# EAGLE design Adafruit High Voltage UPDI Friend (EAGLE 9.6.2)
COMPANY: ADAFRUIT INDUSTRIES; DRAWN: KTOWN; REV: A
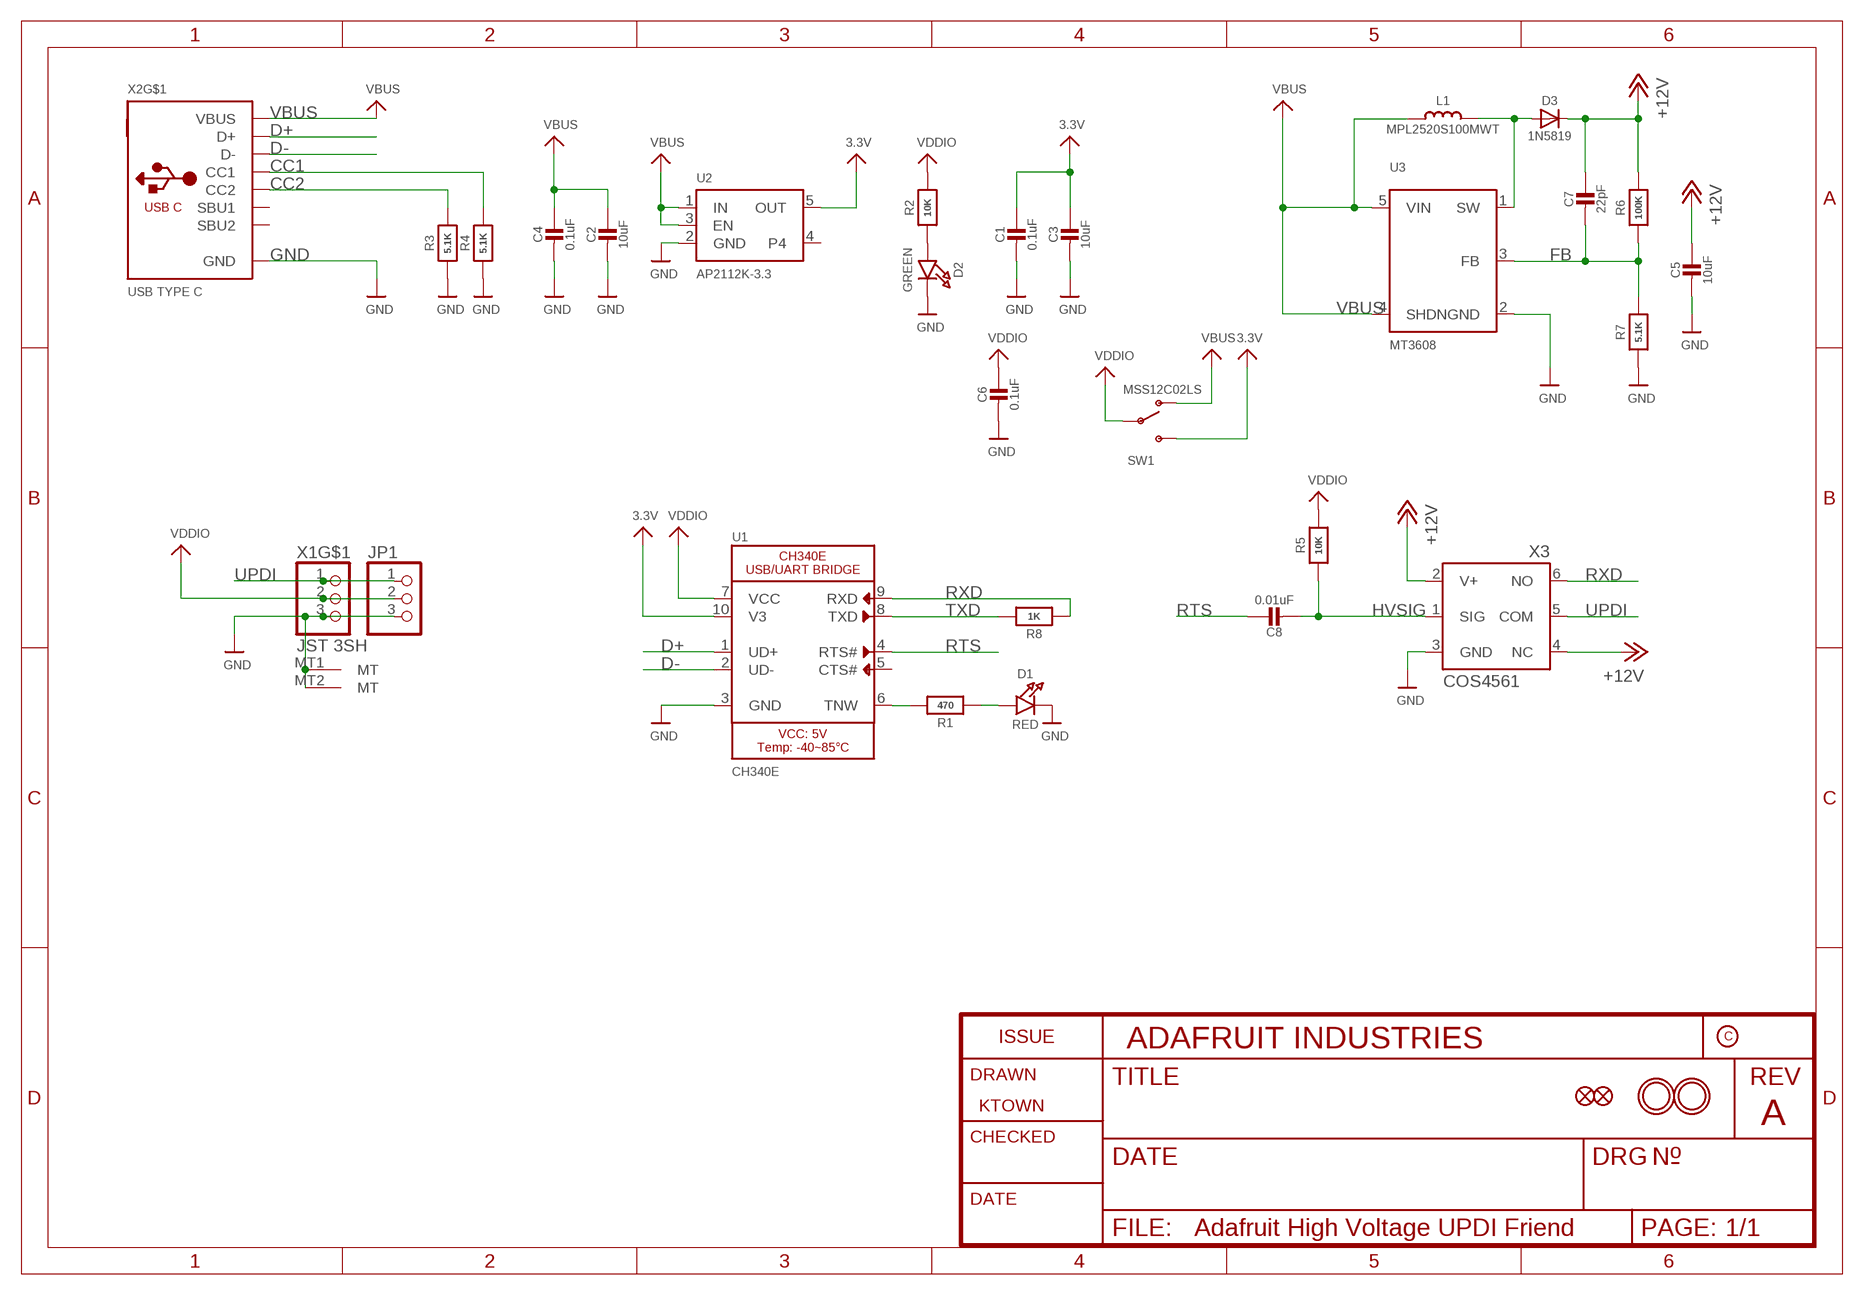
[diagram p0: schematic, sheet 1]

## Parts
C1  0.1uF  CAP_CERAMIC0603_NO  [0603-NO]
C2  10uF  CAP_CERAMIC0805-NOOUTLINE  [0805-NO]
C3  10uF  CAP_CERAMIC0805-NOOUTLINE  [0805-NO]
C4  0.1uF  CAP_CERAMIC0603_NO  [0603-NO]
C5  10uF  CAP_CERAMIC0805-NOOUTLINE  [0805-NO]
C6  0.1uF  CAP_CERAMIC0603_NO  [0603-NO]
C7  22pF  CAP_CERAMIC0603_NO  [0603-NO]
C8  0.01uF  CAP_CERAMIC0603_NO  [0603-NO]
D1  RED  LED0603_NOOUTLINE  [CHIPLED_0603_NOOUTLINE]
D2  GREEN  LED0603_NOOUTLINE  [CHIPLED_0603_NOOUTLINE]
D3  1N5819  DIODESOD-323  [SOD-323]
FID1  FIDUCIAL_1MM  [FIDUCIAL_1MM]
FID2  FIDUCIAL_1MM  [FIDUCIAL_1MM]
JP1  HEADER-1X376MIL  [1X03_ROUND_76]
L1  MPL2520S100MWT  INDUCTOR  [INDUCTOR_1007]
R1  470  RESISTOR_0603_NOOUT  [0603-NO]
R2  10K  RESISTOR_0603_NOOUT  [0603-NO]
R3  5.1K  RESISTOR_0603_NOOUT  [0603-NO]
R4  5.1K  RESISTOR_0603_NOOUT  [0603-NO]
R5  10K  RESISTOR_0603_NOOUT  [0603-NO]
R6  100K  RESISTOR_0603_NOOUT  [0603-NO]
R7  5.1K  RESISTOR_0603_NOOUT  [0603-NO]
R8  1K  RESISTOR_0603_NOOUT  [0603-NO]
SW1  MSS12C02LS  SWITCH_SPDT  [SPDT_SMT_SSSS811101]
U1  CH340E  CH340E_MSOP10  [MSOP10]
U2  AP2112K-3.3  VREG_SOT23-5  [SOT23-5]
U3  MT3608  VREG_BOOST_5PIN_SOT236  [SOT23-6]
U$18  MOUNTINGHOLE2.0  [MOUNTINGHOLE_2.0_PLATED]
U$19  MOUNTINGHOLE2.0  [MOUNTINGHOLE_2.0_PLATED]
X1  JST 3SH  CON_JST_SH_3PINHORZ  [JST_SH3]
X2  USB TYPE C  USB_C  [USB_C_CUSB31-CFM2AX-01-X]
X3  COS4561  [SOT23-6]

## Nets
3.3V: C1.1 C3.1 SW1.C(S) U1.10(V3) U2.5(OUT)
+12V: C5.1 C7.1 D3.C R6.2 X3.2(V+) X3.4(NC)
CC1: R4.2 X2.A5(CC1)
CC2: R3.2 X2.B5(CC2)
D+: U1.1(UD+) X2.A6(D+) X2.B6(D+)
D-: U1.2(UD-) X2.A7(D-) X2.B7(D-)
FB: C7.2 R6.1 R7.2 U3.3(FB)
GND: C1.2 C2.2 C3.2 C4.2 C5.2 C6.2 D1.C D2.C JP1.3 R3.1 R4.1 R7.1 U1.3(GND) U2.2(GND) U3.2(GND) X1.3 X1.MT1(MT) X1.MT2(MT) X2.A1B12(GND) X2.B1A12(GND) X3.3(GND)
HVSIG: C8.2 R5.1 X3.1(SIG)
N$1: D1.A R1.1
N$2: R1.2 U1.6(TNW)
N$3: D3.A L1.P$2 U3.1(SW)
N$5: D2.A R2.1
RTS: C8.1 U1.4(RTS#)
RXD: R8.2 U1.9(RXD) X3.6(NO)
TXD: R8.1 U1.8(TXD)
UPDI: JP1.1 X1.1 X3.5(COM)
VBUS: C2.1 C4.1 L1.P$1 SW1.A(O) U2.1(IN) U2.3(EN) U3.4(SHDN) U3.5(VIN) X2.A4B9(VBUS) X2.B4A9(VBUS)
VDDIO: C6.1 JP1.2 R2.2 R5.2 SW1.B(P) U1.7(VCC) X1.2
Unconnected: U1.5(CTS#) U2.4 X2.A8(SBU1) X2.B8(SBU2) X2.M1(MT) X2.M2(MT) X2.M3(MT) X2.M4(MT)

## Library data of the parts
C1-C8 = microbuilder:CAP_CERAMIC: Ceramic Capacitors For new designs, use the packages preceded by an '_' character since they are more reliable: The following footprints should be used on most boards: _0402 - Standard footprint for regular board layouts _0603 - Standard footprint for regular board layouts _0805 - Standard footprint for regular board layouts _1206 - Standard footprint for regular board layouts For extremely tight-pitch boards where space is at a premium, the following 'micro-pitch' footprints can be used (smaller pads, no silkscreen outline, etc.): _0402MP - Micro-pitch footprint for very dense/compact boards _0603MP - Micro-pitch footprint for very dense/compact boards _0805MP - Micro-pitch footprint for very dense/compact boards _1206MP - Micro-pitch footprint for very dense/compact boards
D1 D2 = microbuilder:LED: LED 0603 - 0603 Surface Mount Package 2mA: Green LED - Low Power (3.9mcd, 2ma, 1.7Vf) - Digikey: 475-2709-2-ND Orange LED - Low Power (9.8mcd, 2ma, 1.8Vf) - Digikey: 475-1194-2-ND Red LED - Low Power (5mcd, 2ma, 1.8Vf) - Digikey: 475-1195-2-ND Yellow LED - Low Power (7mcd, 2ma, 1.8Vf) - Digikey: 475-1196-2-ND 5mA: Blue LED - Low Power (17mcd, 5ma, 2.9Vf) - Digikey: LNJ937W8CRACT-ND 0805 - 0805 Surface Mount Package 2mA: Red LED (8.8mcd, 2mA, 1.8Vf, Clear) - Low Power [Digikey: 475-2510-1-ND] Green LED (5mcd, 2mA, 1.8Vf, Clear) - Low Power [Digikey: 475-2730-1-ND] Yellow LED (11.3mcd, 2mA, 1.8Vf, Clear) - Low Power [Digikey: 475-2555-1-ND] 20mA: Red LED (104mcd, 20mA, Diffused) - LS R976 [Digikey: 475-1278-6-ND] Red LED (12mcd, 20mA, 2.0Vf, Clear) - APT2012EC [Digikey: 754-1128-1-ND] Green LED (15mcd, 20mA, 2.2Vf, Clear) - APT2012GC [Digikey: 754-1131-1-ND] Orange LED (160mcd, 20mA, 2.1Vf, Clear) - APT2012SECK [Digikey: 754-1130-1-ND] 1206 - 1206 Surface Mount Package Green LED (26mcd, 20mA, Diffused) - LG N971 [Digikey: 475-1407-6-ND] Red LED (15mcd, 20mA, Diffused) - LH N974 [Digikey: 475-1416-6-ND] Cree - Cree High-Power Surface Mount LEDs XPEBWT-L1-0000-00D50 - White 111lm 350mA 2.9Vf 6200K 110° XTEAWT-00-0000-00000LEE3 - White 114lm 350mA 2.85Vf 5000K 115° Everlight - Everlight 45-21 Series Surface Mount LEDs 45-21/QK2C-B2832AC2CB2/2T - Warm White 2000mcd 20mA 3.25Vf 3050K 120° 45-21/LK2C-B38452C4CB2/2T - Nuetral White 2000mcd 20mA 3.25Vf 4150K 120° 45-21/LK2C-B50634C6CB2/2T - Cold White 2200mcd 20mA 3.25Vf 5650K 120° PLCC2 Reverse Mount LS T77K-J1L2-1-0-2-R18-Z - Red 11.25mcd 2mA 1.8Vf 630nm 120° LO T77K-L1M2-24-Z - Orange 19.6mcd 2mA 1.8Vf 606nm 120° LY T77K-K2M1-26-Z - Yellow 15.7mcd 2mA 1.8Vf 587nm 120°; ROT: 270
D3 = microbuilder:DIODE: Diode SMA Model Volts Amps Type Vf Ir Digikey # Notes SSA34-E3 40V 3A Schottky 480mV @ 3A 200uA @ 40V SSA34-E3/61TGITR-ND CDBA120-G 20V 1A Schottky 500mV @ 1A 500uA @ 20V 641-1014-6-ND REEL MBRA210 10V 2A Schottky 350mV @ 2A 700uA @ 10V MBRA210LT3 SOD-123 Model Volts Amps Type Vf Ir Order # Notes BAT54T1G 30V 200mA Schottky 800mV @ 200mA 2uA @ 25V BAT54T1GOSTR-ND B0530W 30V 500mA Schottky 430mV @ 500mA 130uA @ 30V B0530W-FDICT-ND REEL MBR120 20V 1A Schottky 340mV @ 1A MBR120VLSFT1GOSCT-ND SOD-323 Model Volts Amps Type Vf Ir Order # Notes PMEG2005EJ 20V 500mA Schottky 355mV @ 500mA 568-4110-1-ND ZLLS410 10V 570mA Schottky 380mV @ 570mA ZLLS410CT-ND 1N4148WS 75V 150mA Silicon/Simple 1V 1N4148WSFSCT-ND REEL SOD-523 Model Volts Amps Type Vf Ir Order # Notes BAT54XV2 30V 200mA Schottky 0.8V @ 100mA BAT54XV2CT-ND TB751S 30V 30mA Schottky RB751S-40TE61CT-ND SOT23-R/W (R = Solder Paste/Reflow Ovens, W = Hand-Soldering) Model Volts Amps Type Vf Ir Order # Notes BAT54FILM 40V 300mA Schottky 497-7162-1-ND POWERDI-5 Model Volts Amps Type Vf Ir Order # Notes PDS560 60V 5A Schottky 670mV @ 5A 150uA @ 60V PDS560DICT-ND
FID1 FID2 = microbuilder:FIDUCIAL: Fiducial Alignment Points Various fiducial points for machine vision alignment.; BOM: EXCLUDE
JP1 = microbuilder:HEADER-1X3: PIN HEADER
L1 = microbuilder:INDUCTOR: Inductors 0603: 10nH Ceramic Inductor - microwire antenna/RF (Digikey: 712-1434-2-ND) 0805: 560nH Ceramic Inductor - RF (Digikey: 553-1047-1-ND) 270nH Ceramic Inductor - Q = 40@250MHz, +-5%, 1 Ohm DC Resistance (Digikey: 535-10506-2-ND) 1007 (2518 Metric) SMT: 10µH 10% 250mOhm 820mA 1007 Inductor (Digikey: 587-2189-1-ND) 22µH 10% 500mOhm 580mA 1007 Inductor (Digikey: 587-2190-1-ND) 47µH 10% 950mOhm 420mA 1007 Inductor (Digikey: 587-2191-1-ND) 47µH 5% 100mOhm 1A 1008 Inductor (Digikey: 732-1816-1-ND) 5.0x5.0mm (Taiyo Yuden NR5040 Series) 6.8µH 20% 2.3A 64mOhm Inductor (Digikey: 587-2374-2-ND) 5.0x5.0mm (TDK VLC5045 Series) 4.7µH 20% 3.3A 34mOhm Inductor (Digikey: 445-6526-1-ND) 6.8µH 20% 2.7A 46mOhm Inductor (Digikey: 445-6527-1-ND) 6.0x6.0mm (TDK VLC6045 Series) 4.7µH 20% 3.8A 27mOhm Inductor (Digikey: 445-6538-2-ND) 6.8µH 20% 3A 41mOhm Inductor (Digikey: 445-6540-1-ND) 6.2µH 30% 2.2A 45mOhm Inductor (Digikey: SRR5028-6R2YCT-ND) - Not TDK VLC6045 but footprint should match 6.0x6.0mm (TDK SLF6045 Series) 6.8uH 30% 2A 33mOhm Inductor (Digikey: 445-4572-1-ND, Mouser: 810-SLF645T6R8N2R0PF) 6.0x6.0mm (Sumida CDRH5D28 Series) 6.2uH 30% 1.8A 45mOhm Inductor (Digikey: 308-1542-1-ND) Taiyo Yuden NR3015T2R2M - 2.2uH 20% 1.5A (Digikey: 587-1648-2-ND, Mouser: 963-NR3015T2R2M) - Used with TI TPS62172 CoilCraft RFID Transponder Coil - MA5532-AE (For use with AS3935 Lightning Sensor) Taiyo Yuden NRH2412T2R2MNGH - 2.2uH 20% 1AA (Digikey: 587-3443-1-ND) - Used with TI LM3671 Vishay IHLP 1.0uH Molded Inductor - 24mOhm DCR, 5A, +/-20%, -55°C-125°C (Digikey: 541-1319-1-ND)
R1-R8 = microbuilder:RESISTOR: Resistors For new designs, use the packages preceded by an '_' character since they are more reliable: The following footprints should be used on most boards: _0402 - Standard footprint for regular board layouts _0603 - Standard footprint for regular board layouts _0805 - Standard footprint for regular board layouts _1206 - Standard footprint for regular board layouts For extremely tight-pitch boards where space is at a premium, the following 'micro-pitch' footprints can be used (smaller pads, no silkscreen outline, etc.): _0402MP - Micro-pitch footprint for very dense/compact boards _0603MP - Micro-pitch footprint for very dense/compact boards _0805MP - Micro-pitch footprint for very dense/compact boards _1206MP - Micro-pitch footprint for very dense/compact boards
SW1 = adafruit_electromech:SWITCH_SPDT: Switch - SPDT SSSS811101 - Horizontal Two Position SMT, 0.3A 4V [Mouser: 688-SSSS811101]
U1 = microbuilder:CH340E: CH340E Full Speed USB to UART Bridge Baud Rates: 50bps - 2Mbps Software compatible with CH341
U2 = adafruit_power:VREG_SOT23-5: SOT23-5 Fixed Voltage Regulators Part Current Out V Out V In V Dropout θJA (°C/W) TJ (°C) Digikey Part No. ADP121 150mA 3.3V 3.4-5.5V 0.09V @ 150mA -- -- ADP121-AUJZ33R7CT-ND ADP121 150mA 3.0V 3.1-5.5V 0.09V @ 150mA -- -- ADP121-AUJZ30R7CT-ND ADP122 300mA 3.3V 3.4-5.5V 0.085V @ 300mA -- -- ADP122AUJZ-3.3-R7CT-ND ADP1712 300mA 3.3V 3.5-5.5V 0.17V @ 300mA -- -- ADP1712AUJZ-3.3-R7TR-ND AP7311 (Low Cost) 150mA 3.3V 3.5-6V 0.15V @ 150mA -- -- AP7311-33WG-7DICT-ND LD39015M18R 150mA 1.8V 1.9V-5.5V 0.08V @ 100mA -- -- 497-6977-1-ND LP2985A-33DBVR 150mA 3.3V 3.3-16V 0.28V @ 150mA 206 150 296-18479-1-ND MCP1824T-3302E/OT 300mA 3.3V 3.5V-6V 0.2V @ 300mA -- -- MCP1824T-3302E/OTCT-ND MIC5205-2.5YM5 TR 150mA 2.5V 2.7-16V 0.165V @ 150mA -- -- 576-1257-2-ND MIC5205-3.0YM5 TR 150mA 3.0V 3.2V-16V 0.165V @ 150mA -- -- 576-1258-2-ND MIC5205-3.3YM5 TR 150mA 3.3V 3.5V-16V 0.165V @ 150mA -- -- 576-1259-2-ND TPS780330220 150mA 3.3V+2.2V 3.6-5.5V 250mV Max -- -- 296-23332-1-ND TDA3663/N1,135 100mA 3.3V 3.5-45V 0.18V @ 50mA -- -- 568-5343-1-ND Max operating temp can be calculated using θJA, TJ (max junction temperature), and power in watts. Set the "Maximum Ambient Temperature" until it reaches TJ ("Max Junction Temperature"), which is the absolute limit for safe use of the regulator: Heat Sink Temperature Calculator <http://www.daycounter.com/Calculators/Heat-Sink-Temperature-Calculator.phtml> For example, With 12V source into a 3.3V LP2985 and a 30mA load, we are dissipating (12V-3.3V) * 0.03A = 0.261W. With a θJA of 206 °C/W, a TJ of 150°C, and 261mW we can safely use the chip without a heat sink up to 75°C (=147.1°C Junction Temperature).; JLC_ROTATION: 0
U3 = adafruit_power:VREG_BOOST_5PIN: FAN5331 - LED/OLED 20V Boost Converter Digikey: FAN5331SXCT-ND
U$18 U$19 = adafruit_electromech:MOUNTINGHOLE: Mounting Hole For #2 screws (0.086"/2.18mm width, 0.094"/2.4mm hole) use 2.5mm; BOM: EXCLUDE
X1 = adafruit_electromech:CON_JST_SH_3PIN
X2 = adafruit_electromech:USB_C: USB Type-C USB 2.0 Connector; LCSC: C165948
X3 = microbuilder:COS4561

## Board
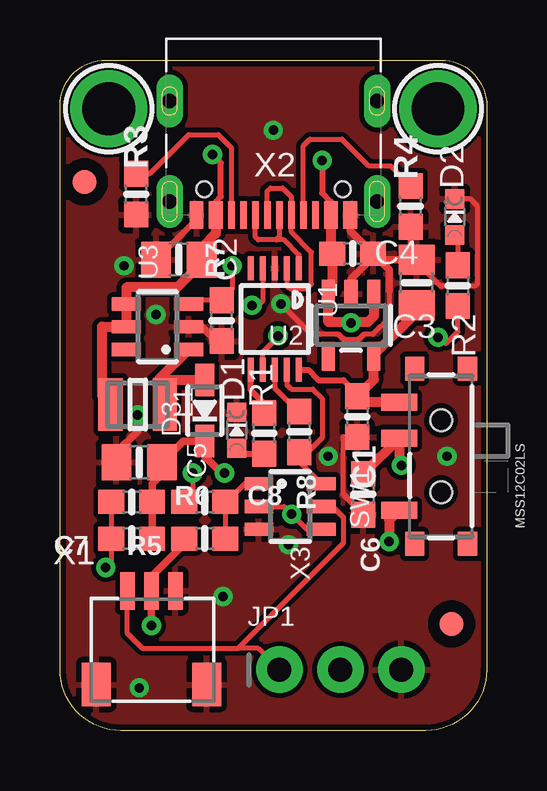
[diagram p1: board, top side]
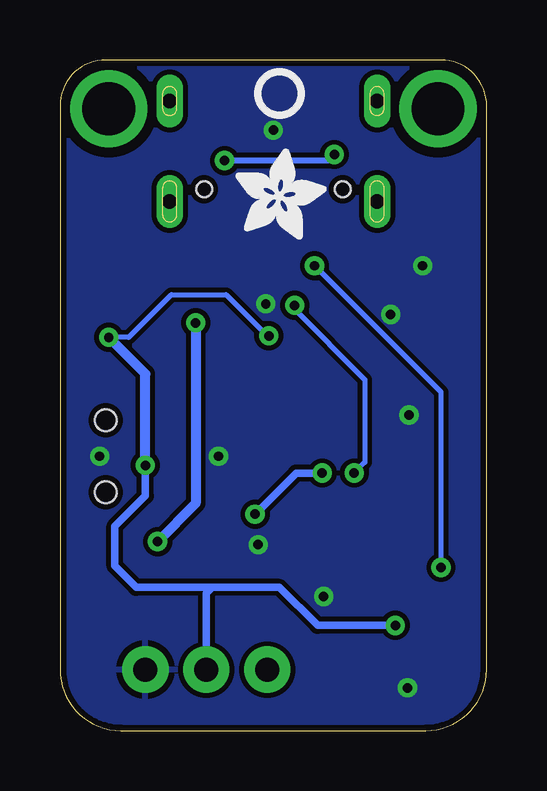
[diagram p2: board, bottom side, seen from below]

Size 17.78 x 27.94 mm. Coordinates in mm from the lower left corner, seen from the top.
Outline: 17.78,26.04 17.78,2.54 arc-90 15.24,0 2.54,0 arc-90 0,2.54 0,26.04 arc-90 1.91,27.94 15.88,27.94 arc-90 17.78,26.04
Copper layers (1*16): Top 0.035mm / dielectric 1.5mm / Bottom 0.035mm
Design rules "adafruit *": minimum track width 8mil, minimum drill 15.5mil, track to track 8mil, track to pad 8mil, pad to pad 8mil, via to via 8mil, smd to smd 8mil, copper to edge 10mil, drill to drill 8mil, minimum pad ring 10mil, minimum via ring 8mil, stop-mask expansion 2mil, vias tented up to drill 20mil, thermal gap 10mil

### Footprints (pad centres in the part's own frame; a part is rotated, then mirrored left to right if it is on the bottom)
0603-NO = smd 1.075 x 1: 1 -0.85,0; 2 0.85,0
0805-NO = smd 1.24 x 1.5: 1 -0.95,0; 2 0.95,0
CHIPLED_0603_NOOUTLINE = smd 0.8 x 0.8: A 0,-0.75; C 0,0.75
SOD-323 = smd 1.35 x 0.8: A 1.27,0; C -1.27,0
FIDUCIAL_1MM = smd 1 x 1: 1 0,0
1X03_ROUND_76 = drill 1 pad 1.93: 1 -2.54,0; 2 0,0; 3 2.54,0
INDUCTOR_1007 = smd 1.016 x 2.2: P$1 -1.127,0; P$2 1.127,0
SPDT_SMT_SSSS811101 = smd 0.7 x 1.5: A -2.25,1.242; B 0.75,1.242; C 2.25,1.242 | smd 1 x 0.8: SUP1 -3.65,0.592; SUP2 -3.65,-1.608; SUP3 3.65,0.592; SUP4 3.65,-1.608 | hole 0.9: -1.5,-0.508; 1.5,-0.508
MSOP10 = smd 0.25 x 1: 1 -1,-2.113; 2 -0.5,-2.113; 3 0,-2.113; 4 0.5,-2.113; 5 1,-2.113; 6 1,2.113; 7 0.5,2.113; 8 0,2.113; 9 -0.5,2.113; 10 -1,2.113
SOT23-5 = smd 0.55 x 1.2: 1 -0.95,-1.3; 2 0,-1.3; 3 0.95,-1.3; 4 0.95,1.3; 5 -0.95,1.3
SOT23-6 = smd 0.55 x 1.2: 1 -0.95,-1.3; 2 0,-1.3; 3 0.95,-1.3; 4 0.95,1.3; 5 0,1.3; 6 -0.95,1.3
MOUNTINGHOLE_2.0_PLATED = drill 2.2 pad 3: P$1 0,0
JST_SH3 = smd 0.6 x 1.55: 1 -1,2.006; 2 0,2.006; 3 1,2.006 | smd 1.2 x 1.8: MT1 -2.3,-1.894; MT2 2.3,-1.894
USB_C_CUSB31-CFM2AX-01-X = smd 0.575 x 1.15: A1B12 -3.2,2.275; A4B9 -2.4,2.275; B1A12 3.2,2.275; B4A9 2.4,2.275 | smd 0.275 x 1.15: A5 -1.25,2.275; A6 -0.25,2.275; A7 0.25,2.275; A8 1.25,2.275; B5 1.75,2.275; B6 0.75,2.275; B7 -0.75,2.275; B8 -1.75,2.275 | drill 0.6 pad 1 long: M1 -4.32,1.7; M2 4.32,1.7; M3 -4.32,-2.48; M4 4.32,-2.48 | hole 0.65: 2.89,1.2; -2.89,1.2

### Placement (x,y rotation side)
C1  12.38,13.08 270 top
C2  4.95,19.62 180 top
C3  14.86,18.67 90 top
C4  12.19,19.88 0 top
C5  3.3,11.18 180 top
C6  12.64,9.84 270 top
C7  2.98,8 180 top
C8  6.03,9.53 0 top
D1  7.37,12.51 0 top
D2  16.45,21.4 0 top
D3  6.03,13.34 90 top
FID1  1.02,22.86 0 top
FID2  16.32,4.45 0 top
JP1  11.68,2.54 0 top
L1  3.24,13.59 0 top
PLABEL0  [PLABEL0]  9.14,3.81 90 top
PLABEL1  [PLABEL1]  11.68,3.81 90 top
PLABEL2  [PLABEL2]  14.22,3.81 90 top
PLABEL3  [PLABEL3]  14.67,16.32 0 top
PLABEL4  [PLABEL4]  14.92,6.35 0 top
PLABEL5  [PLABEL5]  16.38,23.24 0 top
PLABEL6  [PLABEL6]  0.83,14.67 90 top
PLABEL7  [PLABEL7]  8.89,12.06 0 bottom
PLABEL8  [PLABEL8]  2.29,1.02 90 bottom
PLABEL9  [PLABEL9]  3.87,1.02 90 bottom
PLABEL10  [PLABEL10]  5.59,0.95 90 bottom
PLABEL11  [PLABEL11]  6.16,5.46 0 bottom
R1  8.51,12.38 90 top
R2  16.57,18.54 270 top
R3  3.17,22.35 90 top
R4  14.61,21.84 90 top
R5  6.03,8 180 top
R6  2.98,9.53 0 top
R7  6.73,17.08 90 top
R8  9.97,12.45 270 top
SW1  15.37,11.43 90 top
U1  8.95,17.14 180 top
U2  12.13,16.89 180 top
U3  4.06,16.83 90 top
U$17  [PCBFEAT-REV-040]  8.64,26.54 0 bottom
U$18  15.75,25.91 0 top
U$19  2.03,25.91 0 top
U$36  [ADAFRUIT_3.5MM]  10.48,20.45 0 bottom
X1  3.81,3.81 0 top
X2  8.89,23.75 180 top
X3  9.59,9.33 270 top

### Tracks (layer width: path | path; a pad name or v marks a point on that pad's centre or on a via)
3.3V
  Top 0.254: U1.10 10.34,15.03 10.76,14.61 11.81,14.61 12.43,13.98
  Top 0.406: C3.1 14.86,17.43 13.08,15.65 U2.5 13.08,14.63 12.43,13.98 C1.1 12.63,13.68 SW1.C
+12V  (via drill 0.39)
  Top 0.203: X3.2 9.34,9.34 v9.65,9.02 10.28,8.38 X3.4
  Top 0.305: C7.1 R6.2 3.83,10.29 4.25,10.7 C5.1 5.14,12.06 D3.C 6.03,11.43 6.79,10.67 v6.86,10.73
  Bottom 0.305: v6.86,10.73 7.94,10.73 v9.65,9.02
CC1
  Top 0.203: X2.A5 10.14,24.36 10.41,24.64 11.75,24.64 12.87,23.52 13.78,23.52 R4.2
CC2
  Top 0.203: R3.2 3.75,23.2 5.37,24.83 6.6,24.83 7.14,24.29 X2.B5
D+
  Top 0.203: 9.02,20.45 8.26,20.45 8.14,20.56 X2.B6 | U1.1 9.95,19.83 9.34,20.45 9.02,20.45 | X2.A6 9.14,20.57 9.02,20.45
D-
  Top 0.203: X2.A7 8.64,22.48 8.76,22.61 9.27,22.61 9.64,22.24 X2.B7 9.64,20.78 10.48,19.94 10.48,18.61 10.29,18.41 9.58,18.41 9.45,18.54 U1.2
FB  (via drill 0.39)
  Top 0.203: R6.1 C7.2 2.13,7.02 v1.91,6.79 | v7.18,19.37 7.18,18.38 R7.2 5.52,17.93 U3.3
  Bottom 0.203: v1.91,6.79 1.91,14.1 v7.18,19.37
GND  (via drill 0.39)
  Top 0.203: 11.81,9.84 11.81,12.23 | R4.1 14.61,19.87 C3.2 14.86,19.52 15.86,18.52 15.94,18.52 15.95,18.53 17.33,18.53 17.4,18.61 17.4,21.84 17.09,22.15 D2.C | 13.72,18.35 13.72,17.19 13.04,16.51 12.65,16.51 12.42,16.28 11.84,16.28 11.61,16.51 10.48,16.51 v9.21,17.78
  Top 0.254: X2.B1A12 5.69,21.31 C2.2 | C6.2 12.64,9.02 11.81,9.84 | 11.81,12.23 C1.2
  Top 0.305: R7.1 6.5,16.23 5.91,16.83 U3.2 | C5.2 2.35,11.59 3.24,12.48 v3.24,13.14 | X2.A1B12 12.09,20.83 C4.2 | U2.2 12.13,18.84 13.04,19.75 C4.2 | C4.2 13.3,19.62 C3.2 | C4.2 13.72,19.2 13.72,18.35
  other vias: 9.53,7.75 6.79,5.59 16.13,11.43 4,17.34 2.67,19.37 11.18,11.43 3.3,1.78 8.89,25.02
  pour Top: 17.78,27.81 0,27.81 0,0 17.78,0
  pour Bottom: 17.78,27.94 0,27.81 0,0 17.78,0
HVSIG
  Top 0.203: R5.1 C8.2 6.95,9.53 7.71,10.28 X3.1
N$1
  Top 0.254: D1.A 7.52,11.76 7.75,11.53 R1.1
N$2
  Top 0.254: U1.6 7.95,14.17 8.51,13.62 R1.2
N$3
  Top 0.406: U3.1 4.09,14.61 | 4.09,14.61 4.09,13.86 L1.P$2 | D3.A 4.09,14.61
N$5
  Top 0.203: D2.A 16.57,20.52 R2.1
RTS  (via drill 0.39)
  Top 0.203: C8.1 5.52,9.87 v5.52,10.73 | U1.4 8.45,17.91 8.26,17.72 v8,17.72
  Bottom 0.203: v5.52,10.73 5.08,11.18 5.08,14.62 8,17.55 v8,17.72
RXD
  Top 0.203: U1.9 9.45,14.42 9.64,14.23 10.54,14.23 10.92,13.84 10.92,12.19 10.33,11.6 R8.2 9.78,11.6 9.78,11.39 X3.6
TXD
  Top 0.203: U1.8 8.95,14.26 9.91,13.3 R8.1
UPDI
  Top 0.203: X3.5 11.37,9.34 11.81,8.89 11.81,7.81 7.43,3.43 | X1.1 2.81,4.05 3.43,3.43 7.43,3.43 | JP1.1 8.26,3.43 7.43,3.43
VBUS  (via drill 0.39)
  Top 0.254: X2.B4A9 6.49,22.04 6.71,22.26 6.71,23.65 v6.35,24 | v10.92,23.75 10.92,22.41 11.29,22.04 X2.A4B9
  Top 0.406: U2.1 13.08,17.27 12.83,17.02 12.13,17.02 | 12.13,17.02 11.18,17.02 U2.3 11.34,18.36 C4.1 11.29,19.93 X2.A4B9 | L1.P$1 1.75,13.95 1.75,16.83 U3.5 U3.4 2.76,18.46 4.88,18.46 5.9,19.49 C2.1 5.9,20.13 6.49,20.71 X2.B4A9 | SW1.A 13.72,8.77 v13.72,7.87 | v12.13,16.99 12.13,17.02
  Bottom 0.254: v6.35,24 6.6,23.75 v10.92,23.75
  Bottom 0.406: v13.72,7.87 12.13,9.46 v12.13,16.99
VDDIO  (via drill 0.39)
  Top 0.203: U1.7 8.45,15.76 9.08,16.38 v9.08,16.45 | v15.75,16.38 15.81,16.38 16.07,16.13 16.09,16.13 16.57,16.61 R2.2
  Top 0.305: R5.2 5.18,7.79 3.81,6.41 X1.2 v3.81,4.38
  Top 0.406: C6.1 SW1.B 14.12,11.15 v14.22,11.05
  Bottom 0.203: v9.08,16.45 9.14,16.45 10.86,18.16 13.14,18.16 14.92,16.38 v15.75,16.38
  Bottom 0.305: v3.81,4.38 7.05,4.38 8.64,5.97 11.43,5.97 | 11.43,5.97 14.61,5.97 15.49,6.86 15.49,8.51 14.22,9.78 v14.22,11.05 | 11.43,5.97 11.68,5.71 JP1.2
  Bottom 0.406: v14.22,11.05 14.22,14.86 v15.75,16.38

### Text on the board
Pinguin_tBackup: ON | 3V | HV UPDI Friend | 5V | UPDI | PWR | GND
Pinguin_bBackup: CH340E USB Serial / UPDI Programmer / with 12V Pulse / on RTS Signal / 3 or 5V Power/IO | JST-SH | UPDI | PWR | GND